# EAGLE schematic auto week 3 (EAGLE 9.6.2)
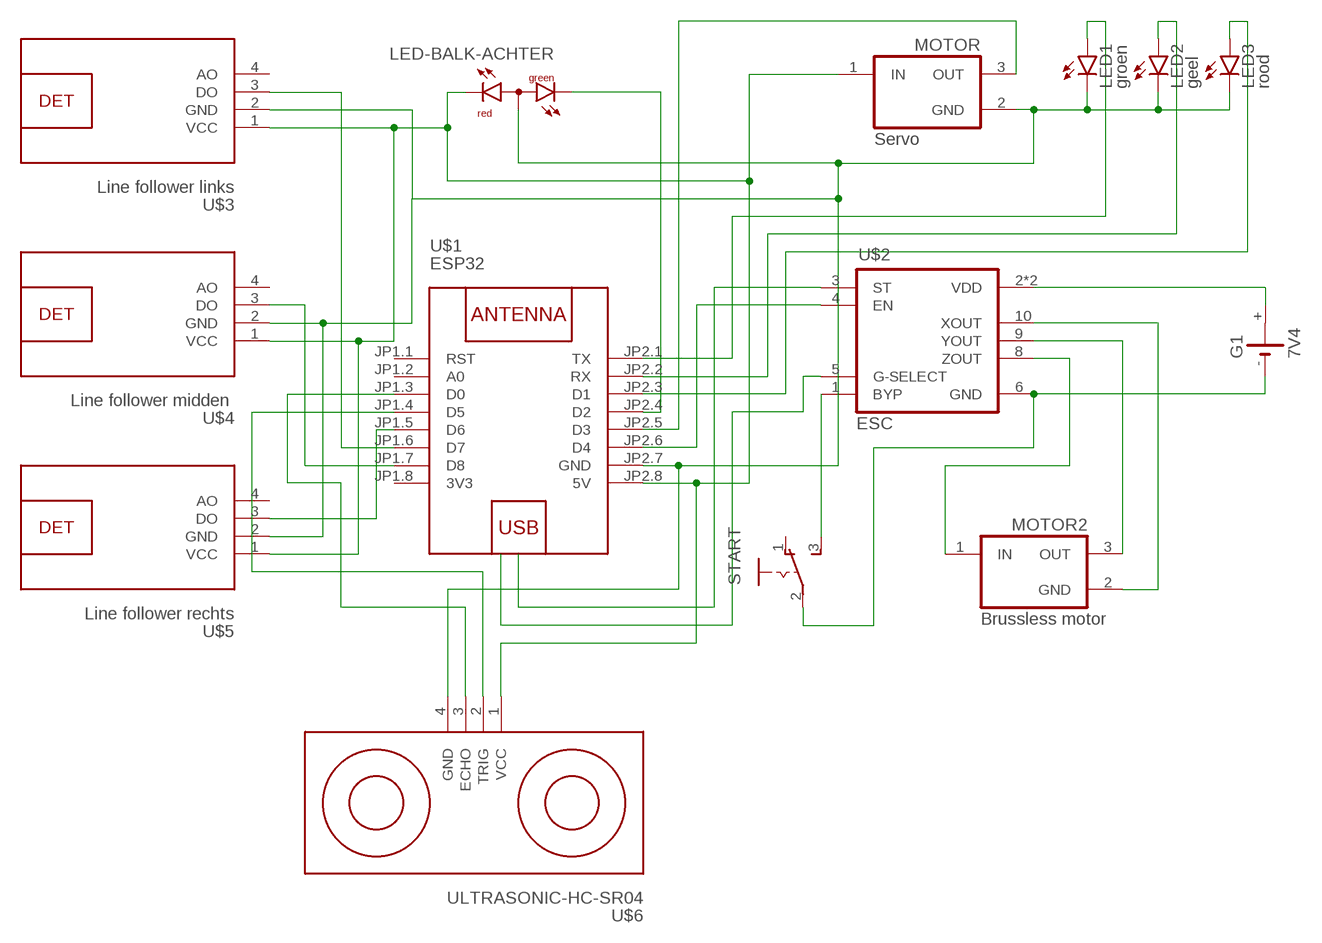
[diagram p0: schematic, sheet 1]

## Parts
G1  7V4  1V60R  [1V60R]
LED1  groen  LAP4-BOTTOM  [P47F-BOTTOM]
LED2  geel  LAP4-BOTTOM  [P47F-BOTTOM]
LED3  rood  LAP4-BOTTOM  [P47F-BOTTOM]
LED-BALK-ACHTER  DUOLED-RG-A  [DUOLED-A-5MM]
MOTOR  Servo  MIC29300-3.3BT  [TO220-S]
MOTOR2  Brussless motor  MIC29300-3.3BT  [TO220-S]
START  255SB  [255SB]
U$1  ESP32  WEMOS-D1-MINI  [WEMOS-D1-MINI]
U$2  ESC  FXLN83XXQ  [QFN12-3X3]
U$3  Line follower links  FLAME-DETECTOR  [FLAME-DETECTOR]
U$4  Line follower midden  FLAME-DETECTOR  [FLAME-DETECTOR]
U$5  Line follower rechts  FLAME-DETECTOR  [FLAME-DETECTOR]
U$6  ULTRASONIC-HC-SR04  [ULTRASONIC-HC-SR04]

## Nets
N$1: LED-BALK-ACHTER.CR MOTOR.1(IN) U$1.JP2.8(5V) U$3.1(VCC) U$4.1(VCC) U$5.1(VCC) U$6.1(VCC)
N$2: LED1.C LED2.C LED3.C LED-BALK-ACHTER.A MOTOR.2(GND) U$1.JP2.7(GND) U$3.2(GND) U$4.2(GND) U$5.2(GND) U$6.4(GND)
N$3: START.3(S) U$2.1(BYP)
N$4: LED1.A U$1.JP2.1(TX)
N$5: G1.- START.2(P) U$2.6(GND)
N$6: G1.+ U$2.2(VDD) U$2.7(VDD)
N$7: U$2.3(ST)
N$9: U$1.JP2.6(D4) U$2.4(EN)
N$10: MOTOR2.1(IN) U$2.8(ZOUT)
N$11: MOTOR2.3(OUT) U$2.9(YOUT)
N$12: MOTOR2.2(GND) U$2.10(XOUT)
N$13: MOTOR.3(OUT) U$1.JP2.5(D3)
N$14: LED-BALK-ACHTER.CX(CG) U$1.JP2.4(D2)
N$15: LED2.A U$1.JP2.2(RX)
N$16: LED3.A U$1.JP2.3(D1)
N$17: U$1.JP1.7(D8) U$4.3(DO)
N$18: U$1.JP1.6(D7) U$3.3(DO)
N$19: U$2.5(G-SELECT)
N$20: U$1.JP1.3(D0) U$6.3(ECHO)
N$21: U$1.JP1.5(D6) U$5.3(DO)
N$22: U$1.JP1.4(D5) U$6.2(TRIG)
Unconnected: G1.+@1(+) START.1(O) U$1.JP1.1(RST) U$1.JP1.2(A0) U$3.4(AO) U$4.4(AO) U$5.4(AO)

## Power pins joined to a net without a drawn wire
3V3: U$1.JP1.8(3V3)

## Library data of the parts
G1 = battery:1V60R: NC ACCU Varta
LED1-LED3 = led:*P4: PointLED® Enhanced Thinfilm LED TOP & BOTTOM mount LS P47F, LR P47F, LA P47F, LY P47F, LT P4SG, LB P4SG, LW P4SG Source: http://catalog.osram-os.com .. LA_LR_LS_LY_P47F_Pb_free.pdf
LED-BALK-ACHTER = led:DUOLED-RG-A: DUO LED 2 colors (red/green), 5 mm, round, common Anode www.ligitek.com or other producers.
MOTOR MOTOR2 = stepper_drivers_etc:MIC29300-3.3BT
START = switch:255SB: SLIDING SWITCH Distributor Buerklin, 11G810
U$1 = diy-modules:WEMOS-D1-MINI: WEMOS D1 mini: Mini Wi-Fi Board based on ESP-8266 device More details can be found here: https://www.wemos.cc/product/d1-mini.html Click here to find device on ebay.com <http://www.ebay.com/sch/wemos+d1+mini+nodemcu>
U$2 = freescale-fxln83xxq:FXLN83XXQ: Features • Supply voltage (V DD ) from 1.71 V to 3.6 V • Accelerometer operating ranges selectable • ±2 gor ±8 g(FXLN83x1Q) • ±4 gor ±16 g(FXLN83x2Q) • Low current consumption of 180 μA (typical) The library has been designed by Richard Magdycz <https://www.facebook.com/groups/eaglecadsoftUK>
U$3-U$5 = diy-modules:FLAME-DETECTOR: Flame Detector Click here to find device on ebay.com <http://www.ebay.com/sch/flame+detector+arduino>
U$6 = diy-modules:ULTRASONIC-HC-SR04: Ultrasonic Ranging Module HC-SR04 More details available here: http://randomnerdtutorials.com/complete-guide-for-ultrasonic-sensor-hc-sr04/ Click here to find device on ebay.com <http://www.ebay.com/sch/hc+sr04+ultrasonic>